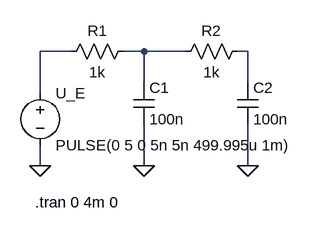
[diagram p0: schematic labor2.asc]
labor2.asc, the LTspice schematic file:
Version 4
SHEET 1 880 680
WIRE 96 64 48 64
WIRE 208 64 176 64
WIRE 272 64 208 64
WIRE 368 64 352 64
WIRE 208 112 208 64
WIRE 368 112 368 64
WIRE 48 128 48 64
WIRE 48 240 48 208
WIRE 208 240 208 176
WIRE 368 240 368 176
FLAG 48 240 0
FLAG 208 240 0
FLAG 368 240 0
SYMBOL voltage 48 112 R0
SYMATTR InstName U_E
SYMATTR Value PULSE(0 5 0 5n 5n 499.995u 1m)
SYMBOL res 192 48 R90
WINDOW 0 0 56 VBottom 2
WINDOW 3 32 56 VTop 2
SYMATTR InstName R1
SYMATTR Value 1k
SYMBOL res 368 48 R90
WINDOW 0 0 56 VBottom 2
WINDOW 3 32 56 VTop 2
SYMATTR InstName R2
SYMATTR Value 1k
SYMBOL cap 192 112 R0
SYMATTR InstName C1
SYMATTR Value 100n
SYMBOL cap 352 112 R0
SYMATTR InstName C2
SYMATTR Value 100n
TEXT 40 296 Left 2 !.tran 0 4m 0

The netlist it stands for:
* labor2.asc
V§U_E N001 0 PULSE(0 5 0 5n 5n 499.995u 1m)
R1 N002 N001 1k
R2 N003 N002 1k
C1 N002 0 100n
C2 N003 0 100n
.tran 0 4m 0
.backanno
.end